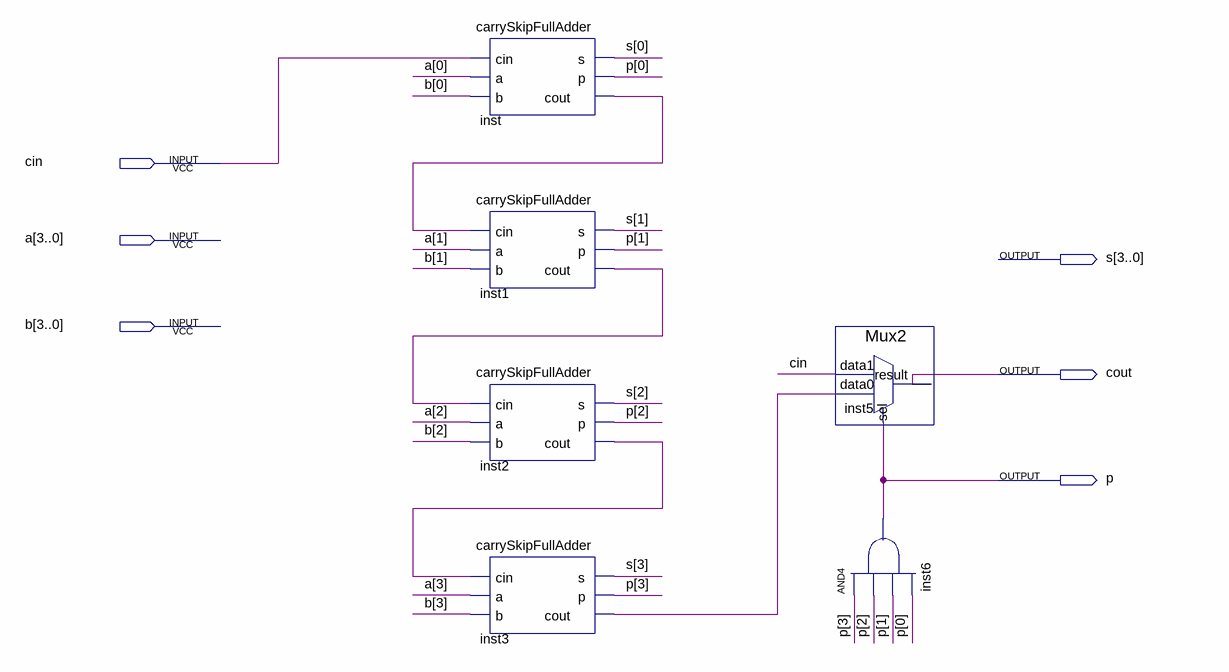
[diagram p0: schematic sheet]
// Quartus schematic carrySkipAdder4.bdf as structural Verilog: 6 symbols, 6 pins
module carrySkipAdder4 (
  input  cin,
  input  [3:0] a,
  input  [3:0] b,
  output [3:0] s,
  output cout,
  output p
);

  wire inst1_cout, inst2_cout, inst3_cout, inst_cout;
  wire [3:0] p_bus;

  carrySkipFullAdder inst (.cin(cin), .a(a[0]), .b(b[0]), .s(s[0]), .p(p_bus[0]), .cout(inst_cout));
  carrySkipFullAdder inst1 (.cin(inst_cout), .a(a[1]), .b(b[1]), .s(s[1]), .p(p_bus[1]), .cout(inst1_cout));
  carrySkipFullAdder inst2 (.cin(inst1_cout), .a(a[2]), .b(b[2]), .s(s[2]), .p(p_bus[2]), .cout(inst2_cout));
  carrySkipFullAdder inst3 (.cin(inst2_cout), .a(a[3]), .b(b[3]), .s(s[3]), .p(p_bus[3]), .cout(inst3_cout));
  Mux2 inst5 (.data1(cin), .data0(inst3_cout), .sel(p), .result(cout));
  and inst6 (p, p_bus[3], p_bus[2], p_bus[1], p_bus[0]);
endmodule
